# EAGLE design shield (EAGLE 7.6.0)
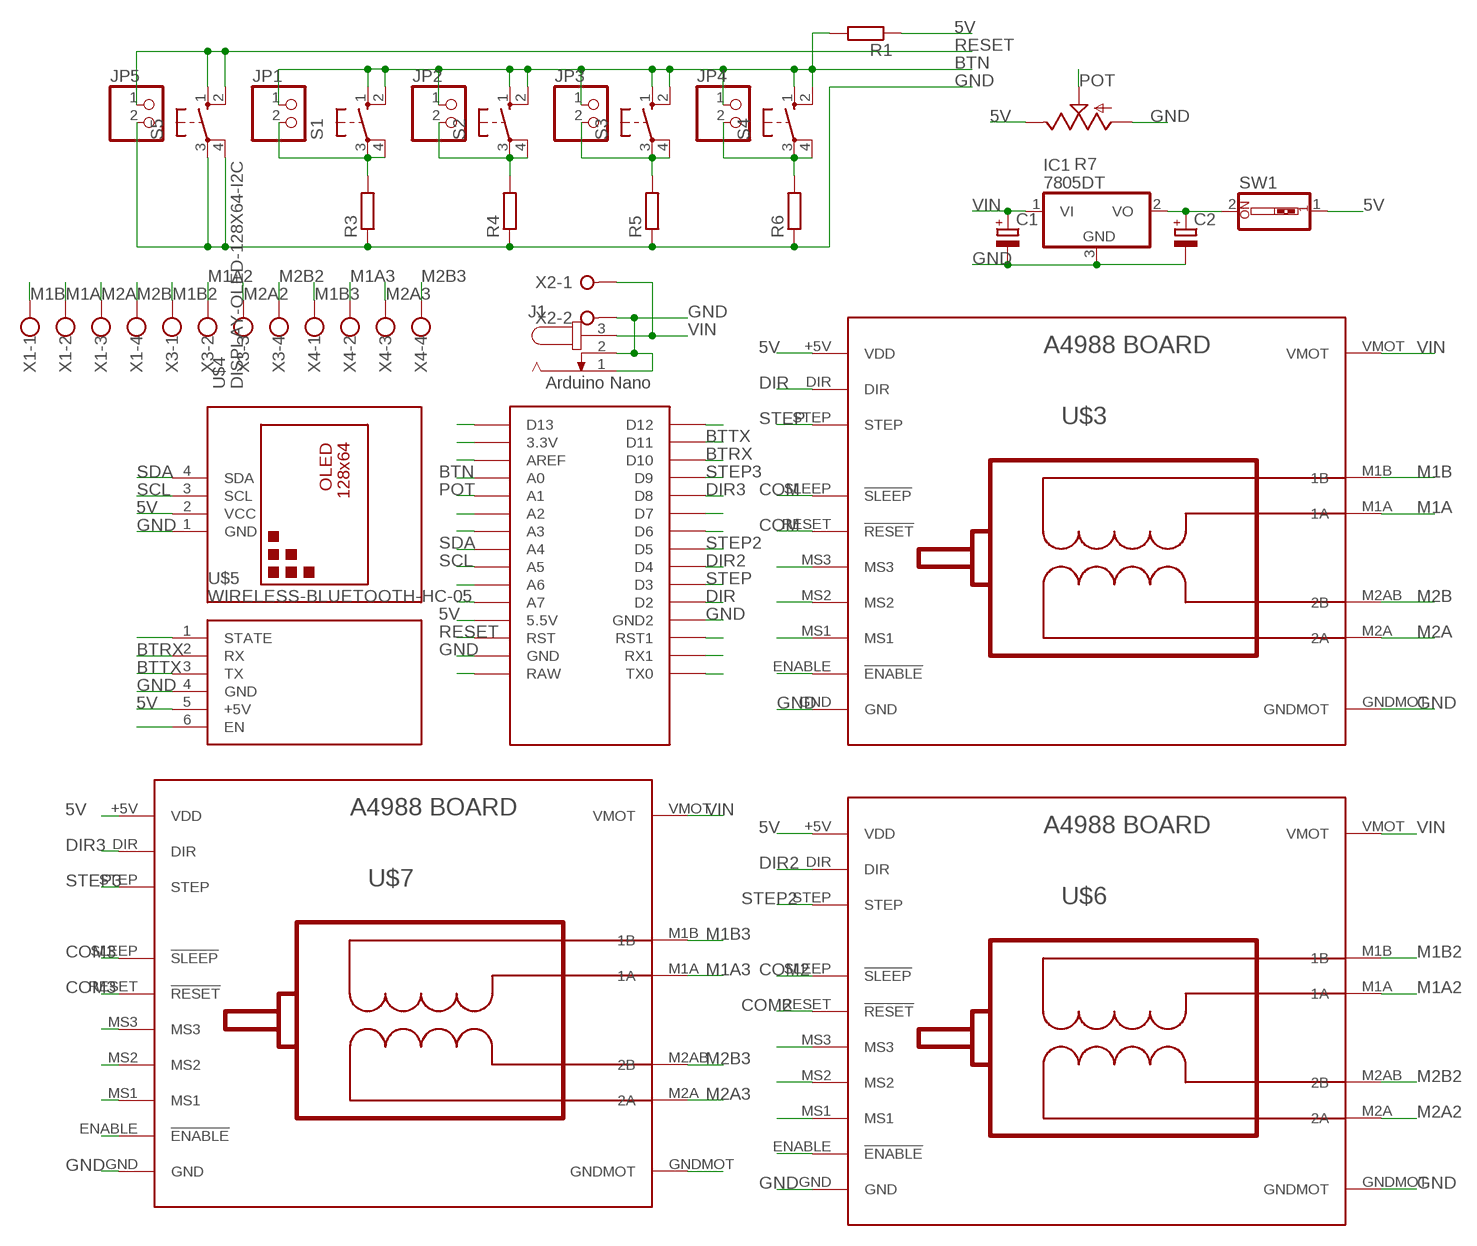
[diagram p0: schematic, sheet 1]

## Parts
C1  CPOL-EUE2.5-7  [E2,5-7]
C2  CPOL-EUE2.5-7  [E2,5-7]
IC1  7805DT  [TO252]
J1  JACK-PLUG1  [SPC4078]
JP1  PINHD-1X2  [1X02]
JP2  PINHD-1X2  [1X02]
JP3  PINHD-1X2  [1X02]
JP4  PINHD-1X2  [1X02]
JP5  PINHD-1X2  [1X02]
R1  R-EU_R1206  [R1206]
R3  R-EU_R1206  [R1206]
R4  R-EU_R1206  [R1206]
R5  R-EU_R1206  [R1206]
R6  R-EU_R1206  [R1206]
R7  TRIM_US-S63S  [S63S]
S1  40-XX  [B3F-40XX]
S2  40-XX  [B3F-40XX]
S3  40-XX  [B3F-40XX]
S4  40-XX  [B3F-40XX]
S5  10-XX  [B3F-10XX]
SW1  SW_DIP-1  [EDG-01]
U$1  NANO  [NANO]
U$3  BOARD_A4988  [BOARD_A4988]
U$4  DISPLAY-OLED-128X64-I2C  [DISPLAY-OLED-128X64-I2C]
U$5  WIRELESS-BLUETOOTH-HC-05  [WIRELESS-BLUETOOTH-HC-05]
U$6  BOARD_A4988  [BOARD_A4988]
U$7  BOARD_A4988  [BOARD_A4988]
X1  W237-4  [W237-4]
X2  W237-02P  [W237-132]
X3  W237-4  [W237-4]
X4  W237-4  [W237-4]

## Nets
5V: R1.1 R7.E SW1.1 U$1.5V(5.5V) U$3.+5V(VDD) U$4.2(VCC) U$5.5(+5V) U$6.+5V(VDD) U$7.+5V(VDD)
BTN: JP1.1 JP2.1 JP3.1 JP4.1 R1.2 S1.1(S) S1.2(S1) S2.1(S) S2.2(S1) S3.1(S) S3.2(S1) S4.1(S) S4.2(S1) U$1.A0
BTN1: JP4.2 R6.2 S4.3(P) S4.4(P1)
BTN2: JP3.2 R5.2 S3.3(P) S3.4(P1)
BTN3: JP2.2 R4.2 S2.3(P) S2.4(P1)
BTN4: JP1.2 R3.2 S1.3(P) S1.4(P1)
BTRX: U$1.D10 U$5.2(RX)
BTTX: U$1.D11 U$5.3(TX)
COM: U$3.RESET(!RESET) U$3.SLEEP(!SLEEP)
COM2: U$6.RESET(!RESET) U$6.SLEEP(!SLEEP)
COM3: U$7.RESET(!RESET) U$7.SLEEP(!SLEEP)
DIR: U$1.D2 U$3.DIR
DIR2: U$1.D4 U$6.DIR
DIR3: U$1.D8 U$7.DIR
GND: C1.- C2.- IC1.3(GND) J1.1 J1.2 JP5.2 R3.1 R4.1 R5.1 R6.1 R7.A S5.3(P) S5.4(P1) U$1.GND U$1.GND1(GND2) U$3.GND U$3.GNDMOT U$4.1(GND) U$5.4(GND) U$6.GND U$6.GNDMOT U$7.GND U$7.GNDMOT X2.2
M1A: U$3.M1A(1A) X1.2
M1A2: U$6.M1A(1A) X3.2
M1A3: U$7.M1A(1A) X4.2
M1B: U$3.M1B(1B) X1.1
M1B2: U$6.M1B(1B) X3.1
M1B3: U$7.M1B(1B) X4.1
M2A: U$3.M2A(2A) X1.3
M2A2: U$6.M2A(2A) X3.3
M2A3: U$7.M2A(2A) X4.3
M2B: U$3.M2AB(2B) X1.4
M2B2: U$6.M2AB(2B) X3.4
M2B3: U$7.M2AB(2B) X4.4
N$4: U$1.D12
N$5: U$6.MS2
N$7: U$1.D6
N$9: U$6.ENABLE(!ENABLE)
N$10: U$1.RST1
N$11: U$1.TX0
N$14: U$1.A6
N$16: U$1.A2
N$18: U$1.3.3V
N$19: U$1.D13
N$22: U$7.ENABLE(!ENABLE)
N$23: U$7.MS2
N$25: U$3.MS2
N$26: U$3.ENABLE(!ENABLE)
N$31: U$7.MS3
N$32: U$7.MS1
N$34: U$5.1(STATE)
N$40: U$6.MS3
N$41: U$5.6(EN)
N$42: U$1.AREF
N$43: U$6.MS1
N$44: U$1.A3
N$46: U$1.A7
N$48: U$1.RAW
N$49: U$1.RX1
N$53: U$1.D7
N$56: U$3.MS3
N$57: U$3.MS1
N$59: C2.+ IC1.2(VO) SW1.2
POT: R7.S U$1.A1
RESET: JP5.1 S5.1(S) S5.2(S1) U$1.RST
SCL: U$1.A5 U$4.3(SCL)
SDA: U$1.A4 U$4.4(SDA)
STEP: U$1.D3 U$3.STEP
STEP2: U$1.D5 U$6.STEP
STEP3: U$1.D9 U$7.STEP
VIN: C1.+ IC1.1(VI) J1.3 U$3.VMOT U$6.VMOT U$7.VMOT X2.1
Unconnected: U$1.ICSP1 U$1.ICSP2 U$1.ICSP3 U$1.ICSP4 U$1.ICSP5 U$1.ICSP6

## Library data of the parts
C1 C2 = Clean-Kong:CPOL-EU: POLARIZED CAPACITOR, European symbol
IC1 = adafruit:78*: Positive VOLTAGE REGULATOR Added bigger pads to the TO-92 package
J1 = con-jack:JACK-PLUG: DC POWER JACK Power Jack, DC, Right Angle, Through Hole, Rated 5A at 16VDC, PC Terminals Distributor: Farnell (www.Farnell.de) Drawing: 84N1161.pdf / 84N1162.pdf Manufacturer: SPC Technology (www.spctechnology.com) Type: SPC4077 / SPC 4078; OC_FARNELL: unknown; OC_NEWARK: unknown
JP1-JP5 = pinhead:PINHD-1X2: PIN HEADER
R1 R3-R6 = Clean-Kong:R-EU_: RESISTOR, European symbol
R7 = pot:TRIM_US-: POTENTIOMETER
S1-S4 = adafruit:40-XX: OMRON SWITCH; MF: OMRON COMPONENTS USA; MPN: B3F-4000; OC_FARNELL: 176434; OC_NEWARK: 36K3105
S5 = switch-omron:10-XX: OMRON SWITCH; MPN: B3F-1000; OC_FARNELL: 176432; OC_NEWARK: 36M3542
SW1 = special:SW_DIP-1: DIP SWITCH
U$1 = Arduino-clone:NANO: Arduino Nano
U$3 U$6 U$7 = Clean-Kong:BOARD_A4988
U$4 = diy-modules:DISPLAY-OLED-128X64-I2C: 128x64 Dot Matrix OLED Module based on SSD1306 chip Variant with I2C interface More details available here: http://www.instructables.com/id/Monochrome-096-i2c-OLED-display-with-arduino-SSD13/ SSD1306 datasheet: https://cdn-shop.adafruit.com/datasheets/SSD1306.pdf Click here to find device on ebay.com <http://www.ebay.com/sch/oled+display+128x64+iic> Note: There are two variants: I2C and SPI. Search for the proper version.
U$5 = diy-modules:WIRELESS-BLUETOOTH-HC-05: Bluetooth Transceiver Module based on HC-05 board Tutorial is available here: https://arduino-info.wikispaces.com/BlueTooth-HC05-HC06-Modules-How-To Click here to find device on ebay.com <http://www.ebay.com/sch/hc-05+module+rs232>
X1 X3 X4 = con-wago-500:W237-4: WAGO SCREW CLAMP; OC_FARNELL: unknown; OC_NEWARK: unknown
X2 = con-wago-508:W237-02P: WAGO SREW CLAMP; OC_FARNELL: unknown; OC_NEWARK: unknown

## Board
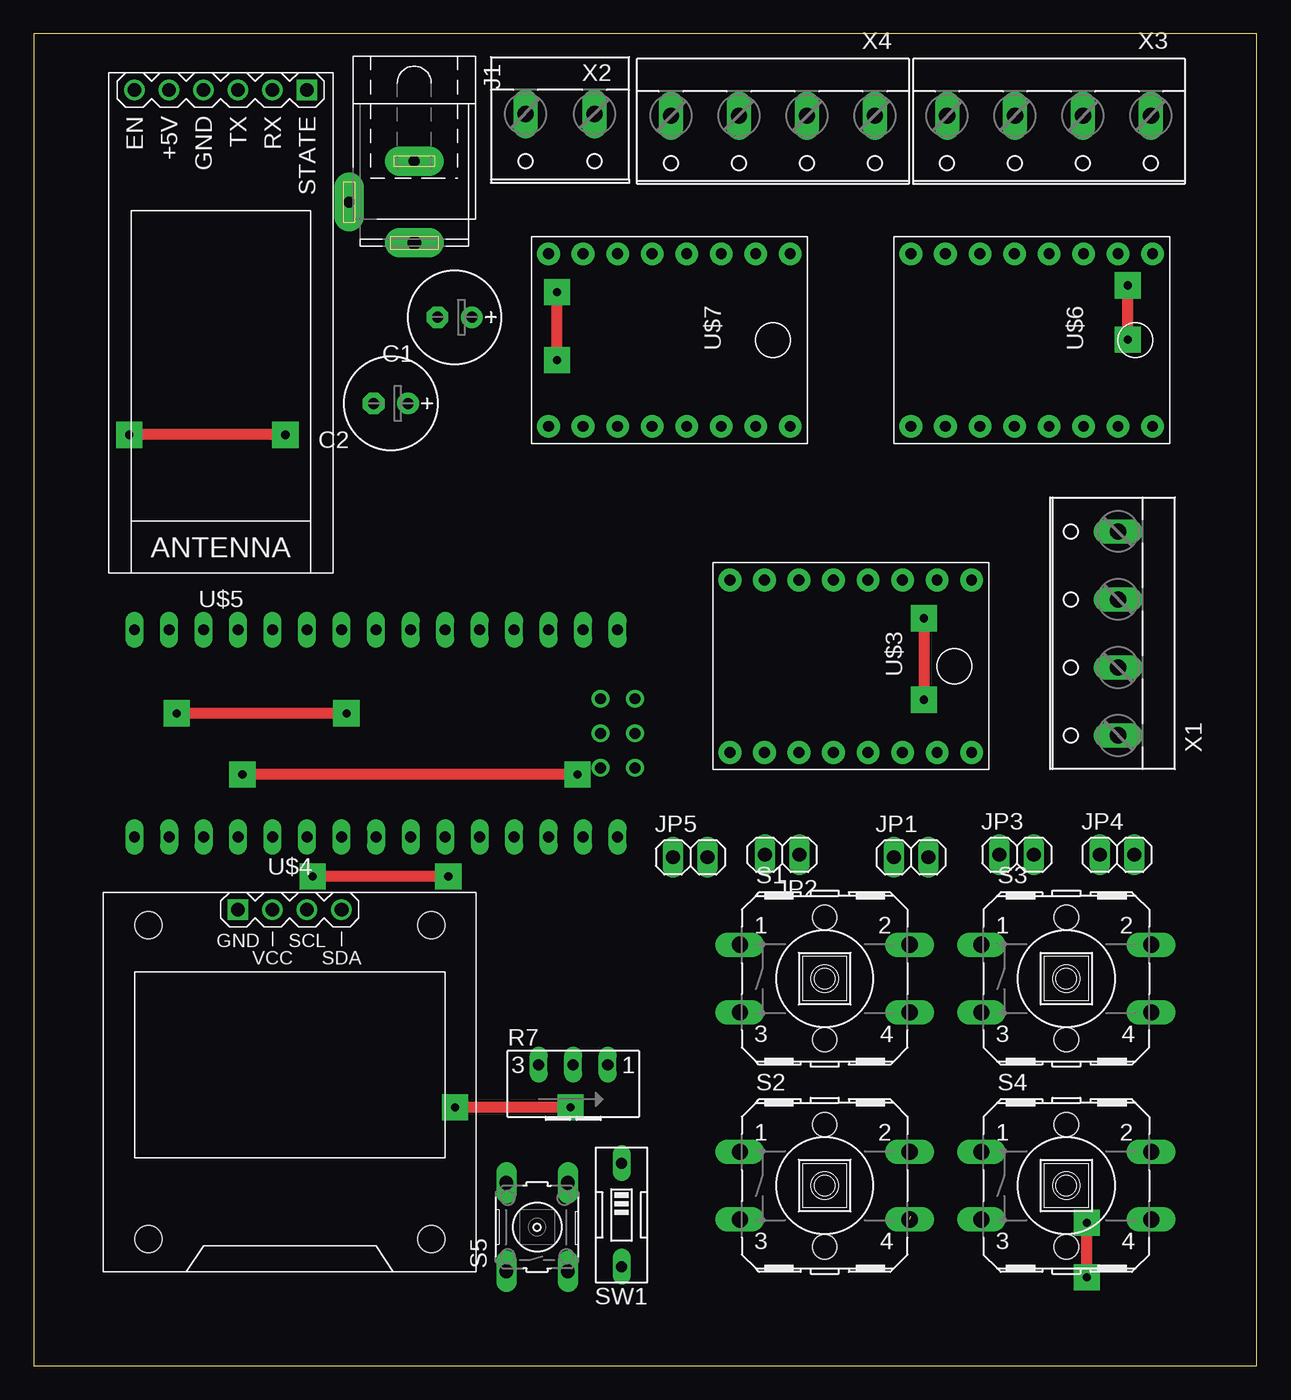
[diagram p1: board, top side]
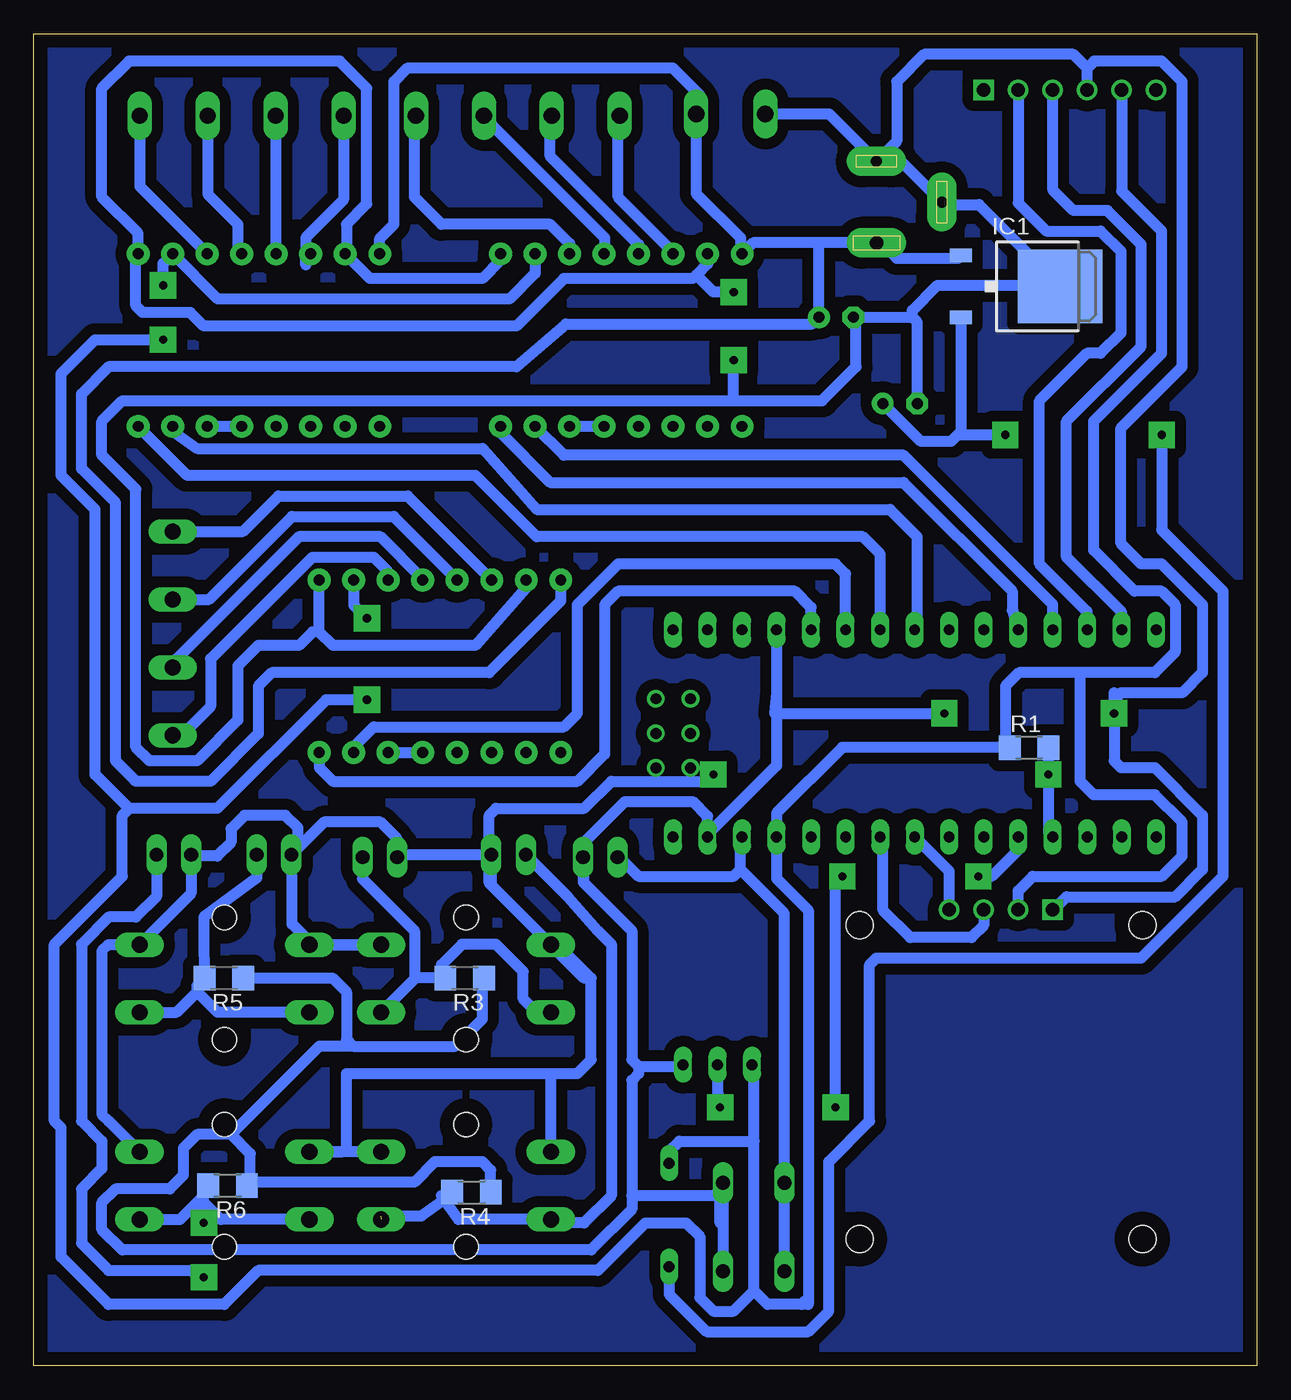
[diagram p2: board, bottom side, seen from below]

Size 90 x 98 mm. Coordinates in mm from the lower left corner, seen from the top.
Outline: 0,0 90,0 90,98 0,98 0,0
Copper layers (1*16): Top 0.035mm / dielectric 1.5mm / Bottom 0.035mm
Design rules "default": minimum track width 10mil, minimum drill 24mil, track to track 8mil, track to pad 8mil, pad to pad 8mil, via to via 8mil, smd to smd 8mil, copper to edge 40mil, drill to drill 8mil, minimum pad ring 10mil, minimum via ring 8mil, stop-mask expansion 4mil, vias tented up to drill 0mil, thermal gap 10mil

### Footprints (pad centres in the part's own frame; a part is rotated, then mirrored left to right if it is on the bottom)
E2,5-7 = drill 0.813 pad 1.6: + -1.27,0 | drill 0.813 pad 1.6 octagon: - 1.27,0
TO252 = smd 1 x 1.6: 1 -2.28,-4.8; 2 2.28,-4.8 | smd 5.4 x 6.2: 3 0,2.5
SPC4078 = drill 0.8 pad 2.184 long: 1 -3,0; 2 0,-4.8 | drill 1 pad 2.184 long: 3 3,0
1X02 = drill 1.016 long: 1 -1.27,0; 2 1.27,0
R1206 = smd 1.6 x 1.803: 1 -1.422,0; 2 1.422,0
S63S = drill 0.813 long: A 2.54,1.27; E -2.54,1.27; S 0,1.27
B3F-40XX = drill 1.194 long: 1 -6.248,2.489; 2 6.248,2.489; 3 -6.248,-2.489; 4 6.248,-2.489 | hole 1.803: 0,-4.496; 0,4.496
B3F-10XX = drill 1.016 long: 1 -3.251,2.261; 2 3.251,2.261; 3 -3.251,-2.261; 4 3.251,-2.261
EDG-01 = drill 0.813 long: 1 0,-3.81; 2 0,3.81
NANO = drill 0.8 long: 3.3V -10.16,24.13; 5V -10.16,-1.27; A0 -10.16,19.05; A1 -10.16,16.51; A2 -10.16,13.97; A3 -10.16,11.43; A4 -10.16,8.89; A5 -10.16,6.35; A6 -10.16,3.81; A7 -10.16,1.27; AREF -10.16,21.59; D2 5.08,1.27; D3 5.08,3.81; D4 5.08,6.35; D5 5.08,8.89; D6 5.08,11.43; D7 5.08,13.97; D8 5.08,16.51; D9 5.08,19.05; D10 5.08,21.59; D11 5.08,24.13; D12 5.08,26.67; D13 -10.16,26.67; GND -10.16,-6.35; GND1 5.08,-1.27; RAW -10.16,-8.89; RST -10.16,-3.81; RST1 5.08,-3.81; RX1 5.08,-6.35; TX0 5.08,-8.89 | drill 0.8: ICSP1 -5.08,-10.16; ICSP2 -5.08,-7.62; ICSP3 -2.54,-10.16; ICSP4 -2.54,-7.62; ICSP5 0,-10.16; ICSP6 0,-7.62
BOARD_A4988 = drill 0.8 pad 1.676: +5V 1.27,16.51; DIR 13.97,19.05; ENABLE 13.97,1.27; GND 1.27,19.05; GNDMOT 1.27,3.81; M1A 1.27,11.43; M1B 1.27,13.97; M2A 1.27,8.89; M2AB 1.27,6.35; MS1 13.97,3.81; MS2 13.97,6.35; MS3 13.97,8.89; RESET 13.97,11.43; SLEEP 13.97,13.97; STEP 13.97,16.51; VMOT 1.27,1.27
DISPLAY-OLED-128X64-I2C = drill 1 square: 1 -3.81,12.7 | drill 1: 2 -1.27,12.7; 3 1.27,12.7; 4 3.81,12.7 | hole 2: -10.414,11.557; 10.414,11.557; 10.414,-11.557; -10.414,-11.557
WIRELESS-BLUETOOTH-HC-05 = drill 1 square: 1 -6.35,-17.145 | drill 1: 2 -3.81,-17.145; 3 -1.27,-17.145; 4 1.27,-17.145; 5 3.81,-17.145; 6 6.35,-17.145
W237-4 = drill 1.194 long: 1 -7.5,-1.27; 2 -2.5,-1.27; 3 2.5,-1.27; 4 7.5,-1.27
W237-132 = drill 1.194 long: 1 -2.54,-0.635; 2 2.54,-0.635

### Placement (x,y rotation side)
C1  30.96,77.15 180 top
C2  26.26,70.81 180 top
IC1  16.98,79.42 270 bottom
J1  27.99,85.63 270 top
JP1  64.55,37.41 0 top
JP2  55.07,37.59 180 top
JP3  72.33,37.59 0 top
JP4  79.71,37.59 0 top
JP5  48.31,37.41 0 top
R1  16.76,45.46 0 bottom
R3  58.3,28.52 180 bottom
R4  57.8,12.76 180 bottom
R5  76.02,28.52 180 bottom
R6  75.75,13.26 180 bottom
R7  39.69,20.86 0 top
S1  58.2,28.48 0 top
S2  58.2,13.24 0 top
S3  75.98,28.48 0 top
S4  75.98,13.24 0 top
S5  37.03,10.19 90 top
SW1  43.25,11.08 180 top
U$1  34.07,49.07 90 top
U$3  49.96,59.09 270 top
U$4  18.83,20.86 0 top
U$5  13.75,76.74 180 top
U$6  63.28,83.09 270 top
U$7  36.61,83.09 270 top
X1  78.52,53.88 90 top
X2  38.72,91.48 180 top
X3  74.71,90.71 180 top
X4  54.39,90.71 180 top

### Tracks (layer width: path | path; a pad name or v marks a point on that pad's centre or on a via)
5V  (via drill 0.6 pad 1.93)
  Top 0.813: v65.5,55 v65.5,49 | v80.5,75.5 v80.5,79.5
  Bottom 0.813: U$7.+5V 53.12,80.38 55,78.5 76.47,78.5 U$6.+5V 80.5,81.11 v80.5,79.5 | U$5.5 9.94,86.44 7,83.5 7,74.5 12,69.5 12,60 9,57 7,57 6,56 6,52.5 7.5,51 13,51 | 13,51 17.5,51 18.5,50 18.5,45.78 R1.1 18.11,45.39 18.39,45.39 18.5,45.5 30.5,45.5 35.34,40.66 U$1.5V 35.34,35.84 33,33.5 33,5 | U$4.2 17.56,34.94 16.5,36 7,36 5.5,37.5 5.5,40 7.5,42 12,42 13,43 13,51 | 33,5 33.5,4.5 | 33.5,4.5 36,4.5 37,5.5 | 37,5.5 37,16.5 | 37,16.5 37,21.98 R7.E | SW1.1 43.25,15.75 42.5,16.5 37,16.5 | U$3.+5V 66.47,55.97 v65.5,55 | v65.5,49 68.5,49 76.5,41 83,41 | 83,41 85.5,43.5 85.5,63 88,65.5 88,73 85.5,75.5 v80.5,75.5 | 33,5 33,4.5 33.5,4.5 | 37,5.5 38.5,4 40,4 41,5 41,9.5 42,10.5 45,10.5 48.5,7 73.5,7 76,4.5 84.5,4.5 88,8 88,17.5 88.5,18 88.5,31 83.5,36 83.5,40.5 83,41
BTN  (via drill 0.6 pad 1.93)
  Top 0.813: v40,43.5 v15.34,43.5
  Bottom 0.813: 14.84,39.09 U$1.A0 15.34,39.23 v15.34,43.5 R1.2 | S3.1 S1.2 69.47,30.97 71,32.5 71,35.65 JP3.1 70.58,38.08 | 84.5,18 S4.2 84.5,18 | 52,21.5 67,21.5 67,16 67.27,15.73 S4.1 S2.2 | 52,21.5 50,21.5 49,22.5 49,28.5 | 49,28.5 51.5,31 | S2.1 51.95,21.45 52,21.5 | JP4.1 78.44,34.76 S3.2 84.53,30.97 85,30.5 85,18.5 84.5,18 | 70.58,38.08 68.65,40 64.5,40 63.28,38.78 JP1.1 63.1,37.59 JP2.1 56.34,35.36 S1.1 49.48,28.5 | JP4.1 78.44,38.56 | 70.58,38.08 70.58,39.58 71.5,40.5 74.5,40.5 75.5,39.5 75.5,38.5 76.5,37.5 78.35,37.5 JP4.1 | 49,28.5 49.48,28.5 | 49.48,28.5 49.5,28.5 56.5,35.5 56.5,40.5 56,41 49.5,41 47.5,43 40,43 v40,43.5
BTN1  (via drill 0.6 pad 1.93)
  Top 0.813: v77.5,6.5 v77.5,10.5
  Bottom 0.813: S4.3 76.25,10.75 77.25,11.75 | 77.25,11.75 77.5,12 77.5,12.93 R6.2 | S4.4 79.25,10.75 77.17,12.83 | 77.17,12.83 77,13 77,13.09 R6.2 | R6.2 77.17,12.83 | JP4.2 80.98,34.52 82.5,33 84.5,33 86.5,31 86.5,18 85,16.5 85,14.5 86.5,13 86.5,9 84.5,7 78.5,7 v77.5,6.5 | v77.5,10.5 77.5,11.5 77.25,11.75
BTN2
  Bottom 0.813: S3.3 76.49,25.99 78,27.5 | 78,27.5 78,27.96 R5.2 77.5,30.58 77.5,33 73.6,35.9 JP3.2 | S3.4 79.51,25.99 78,27.5
BTN3  (1 unrouted)
  Bottom 0.813: 65,10.5 64.5,11 61.5,11 59.72,12.28 R4.2 59.5,12.48 60,12.5 58.75,10.75 S2.3 51.7,10.5 49.5,10.5 47.5,12.5 47.5,31 48.5,32 50.71,34.5 JP2.2
BTN4
  Bottom 0.813: JP1.2 65.82,35.82 62,32 62,28.44 | 62,28.44 S1.4 | 62,28.44 61.92,28.52 R3.2 60,28.8 60,29.5 58.5,31 56,31 54,29 54,27 52.99,25.99 S1.3
BTRX
  Bottom 0.813: U$5.2 17.56,85.56 15.5,83.5 11.5,83.5 10,82 10,76 11.5,74.5 12.5,74.5 16,71 16,59 12.5,55.5 12.5,54.17 U$1.D10
BTTX
  Bottom 0.813: U$5.3 15,93.86 15,86.5 13.5,85 11,85 8.5,82.5 8.5,75 14,69.5 14,59.5 9.94,55.44 U$1.D11
COM
  Bottom 0.813: U$3.SLEEP U$3.RESET
COM2
  Bottom 0.813: U$6.RESET U$6.SLEEP
COM3
  Bottom 0.813: U$7.RESET U$7.SLEEP
DIR
  Bottom 0.813: U$3.DIR 69.01,44.01 68,43 50,43 48,45 48,56 47,57 34,57 32.8,55.8 U$1.D2
DIR2
  Bottom 0.813: U$1.D4 27.72,59.72 29,61 53,61 57.5,65.5 78.71,65.5 U$6.DIR
DIR3
  Bottom 0.813: U$7.DIR 55.66,68.66 52,65 26,65 18,57 18,55.59 U$1.D8
GND  (via drill 0.6 pad 1.93)
  Top 0.813: v38.5,74 v38.5,79 | v23,48 v10.5,48
  Bottom 0.813: U$7.GND 55.66,81.34 57,80 65.27,80 U$6.GNDMOT 67,81.91 67,84 65.5,85.5 65.5,94 67.5,96 83,96 85,94 85,86 82.33,83.33 U$6.GND 82.5,81.65 82.5,78 82,77.5 78.5,77.5 77.5,76.5 54.5,76.5 51,80 41.5,80 41.25,80.25 | U$7.GNDMOT 40.42,81.08 41.25,80.25 | X2.2 31.48,92.11 J1.1 | J1.1 26.19,88.63 J1.2 23,85.44 20.44,85.44 15,80 15,79.94 IC1.3 14.9,79 15.5,79 16,79.5 23.5,79.5 25.35,77.65 25.35,77.15 | U$5.4 12.48,95.48 | 12.48,95.48 13.5,96.5 24.5,96.5 26.5,94.5 26.5,90.12 J1.1 | 25.35,77.15 C1.- 29.5,76.96 29.5,73.5 32,71 38.5,71 | C2.- 24.99,76.79 25.35,77.15 | U$3.GNDMOT 53.77,57.23 57.5,53 68,53 69,54 | 40.5,38.99 U$1.GND | U$1.GND1 35.34,49.5 | 35.34,49.5 35.34,44.16 40.42,39.08 U$1.GND | U$4.1 14.94,33.56 14,34.5 6,34.5 4,36.5 4,40.5 7.5,44 10,44 10.5,44.5 10.5,49 10.25,49.25 | 12.48,95.48 11.96,96 7,96 5.5,94.5 5.5,73.5 10,69 10,60.5 8.5,59 7,59 4,56 4,51 5.5,49.5 10,49.5 10.25,49.25 | R4.1 56.38,14.38 57,15 60.5,15 62,13.5 74.09,13.5 | 74.09,13.5 R6.1 | 74.09,13.5 74.09,15.59 75.5,17 | 75.5,17 78,17 79,16 79,14 80,13 84,13 85,12 85,10 83.5,8.5 49,8.5 46,11.5 46,12.5 | 49.5,37.49 JP5.2 49.58,35.58 49.5,35.5 | 45.5,22 46,22.5 46,32 49.5,35.5 | 45.5,22 42.36,22 R7.A | 45.5,22 45.5,21.5 46,21 46,12.5 | S5.3 S5.4 39.29,10.71 39.5,10.5 39.5,13 | R5.1 68.02,28.52 67,27.5 67,24 66.5,23.5 | 66.5,23.5 59,23.5 57,25.5 57,28.4 R3.1 | 66.5,23.5 69,23.5 75.5,17 | 38.5,71 83.5,71 85,69.5 85,67 82.5,64.5 82.5,45.5 81.5,44.5 78,44.5 75,47.5 75,51.5 73.5,53 70.5,53 69.5,54 69,54 | 38.5,71 v38.5,74 | v38.5,79 40,79 41.25,80.25 | 69,54 U$3.GND | 39.5,13.5 39.5,13 | 39.5,13 40,12.5 46,12.5 | 49.5,35.5 49.5,38.5 46.5,41.5 41.5,41.5 40.42,40.42 U$1.GND
  Bottom 0.813: 35.34,49.5 35.5,48 v23,48 | v10.5,48 10.5,49.5 10.25,49.25
M1A
  Bottom 0.813: U$3.M1A 61.39,57.89 64.5,61 70.5,61 79.5,52 79.67,51.5 X1.2
M1A2
  Bottom 0.813: X3.2 77.21,86.21 75,84 75,82.11 U$6.M1A
M1A3
  Bottom 0.813: X4.2 56.89,91.89 48,83 48,81.86 U$7.M1A
M1B
  Bottom 0.813: U$3.M1B 64,57.89 64,58.5 65,59.5 69.5,59.5 77,52 77,48.5 79.5,46 80.17,46 | 80.5,46 80.17,46 | 80.17,46 X1.1
M1B2
  Bottom 0.813: X3.1 82.21,86.78 U$6.M1B
M1B3
  Bottom 0.813: U$7.M1B 50.58,82.58 52,84 60,84 62,86 62,91.87 X4.1
M2A
  Bottom 0.813: X1.3 77.12,56.38 71,62.5 63.53,62.5 U$3.M2A
M2A2
  Bottom 0.813: X3.3 72.21,81.86 U$6.M2A
M2A3
  Bottom 0.813: U$7.M2A 45.5,82.5 52,89 52,91.87 X4.3
M2B
  Bottom 0.813: X1.4 74.62,61.38 72,64 62.49,64 U$3.M2AB
M2B2
  Bottom 0.813: X3.4 67.21,85.79 70,83 70,81.45 | 70,81 70,81.45 | 70,81.45 U$6.M2AB
M2B3
  Bottom 0.813: U$7.M2AB 42.96,81.96 47,86 47,91.87 X4.4
N$1
  pour Bottom (isolate 0.813): 0,98 90,98 90,0 0,0
N$59  (via drill 0.6 pad 1.93)
  Top 0.813: v18.5,68.5 v7,68.5
  Bottom 0.813: 43.25,6.25 SW1.2 43.25,5.25 40.5,2.5 33,2.5 31.5,4 31.5,15 28.5,18 28.5,29.5 28,30 8.5,30 2.5,36 2.5,57 7,61.5 v7,68.5 | IC1.2 21.78,68.72 22,68.5 | C2.+ 24.72,68 22.5,68 22,68.5 | 22,68.5 v18.5,68.5
POT  (via drill 0.6 pad 1.93)
  Top 0.813: v39.5,19 v31,19 | v30.5,36 v20.5,36
  Bottom 0.813: U$1.A1 17.56,37.94 19.5,36 v20.5,36 | R7.S 39.69,20.19 v39.5,19 | v31,19 31,35.5 v30.5,36
RESET
  Bottom 0.813: S5.1 S5.2 34.77,33.27 38,36.5 | U$1.RST 38,38.79 38,36.5 | JP5.1 46.91,37.41 45.5,36 38.5,36 38,36.5
SCL
  Bottom 0.813: U$4.3 20.1,32.4 21,31.5 25.5,31.5 27.5,33.5 27.5,38.69 U$1.A5
SDA
  Bottom 0.813: U$4.4 22.64,36.37 U$1.A4
STEP
  Bottom 0.813: U$1.D3 30.26,58.26 31,59 47,59 50,56 50,48 51,47 65,47 66.47,45.53 U$3.STEP
STEP2
  Bottom 0.813: U$6.STEP 79.79,68.79 78,67.5 57,67.5 53,63 27,63 25,61 25,55.33 U$1.D5
STEP3
  Bottom 0.813: U$1.D9 15.02,56.02 26,67 51,67 U$7.STEP
VIN
  Bottom 0.813: U$6.VMOT 64.55,82.95 63.5,84 63.5,94.5 62.5,95.5 43,95.5 41,93.5 41,91.86 | 41,91.5 41,91.86 | 41,91.86 X2.1 41.26,86.26 38,83 38,81.94 U$7.VMOT 37.07,82.63 32.5,82.63 | 32.5,82.63 J1.3 27.63,82.63 26.5,81.5 21.98,81.5 IC1.1 | 32.5,82.63 32.23,82.36 C1.+ 32.73,76.65 50.85,76.65 54.5,73.5 84.5,73.5 86.5,71.5 86.5,66 84,63.5 84,44.5 82.75,43.25 82.5,43 77,43 73.5,46.5 73.5,50 72.5,51 56.5,51 51.23,56.27 U$3.VMOT